# Altium schematic sheet MCU.SchDoc
size A3
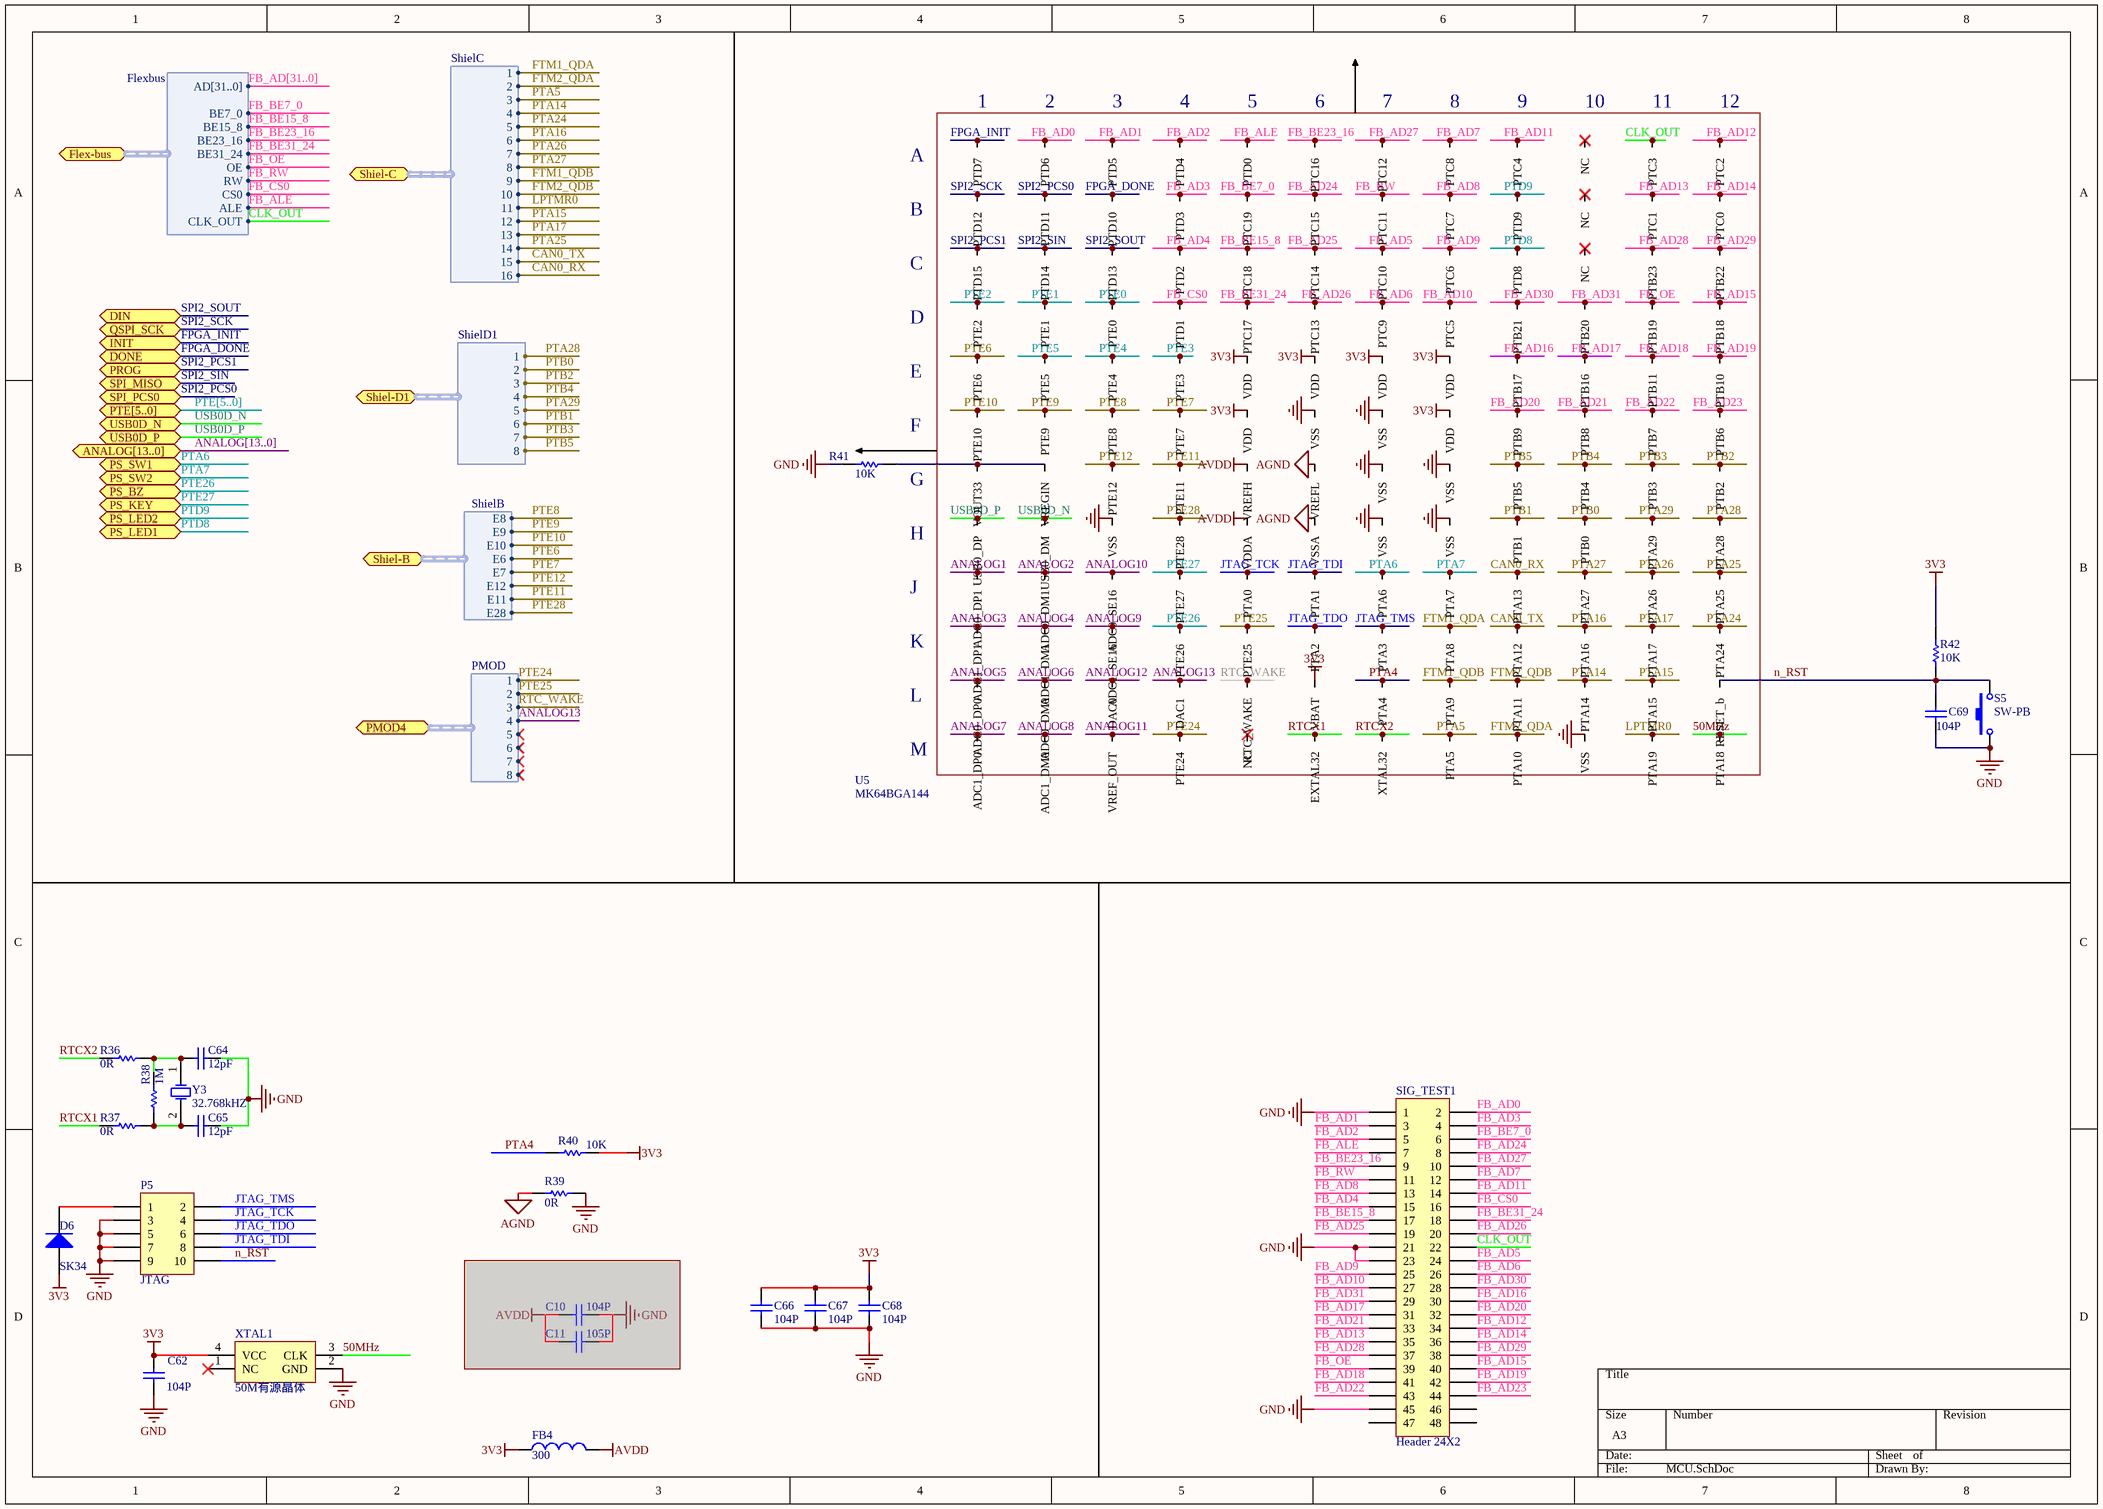
[diagram p0: MCU.SchDoc]

## Parts
C10  value 104P  [0402]  (hidden comment: Cap)  (masked out: inside a compile mask, not in the netlist)
C11  value 105P  [0402]  (hidden comment: Cap)  (masked out: inside a compile mask, not in the netlist)
C62  value 104P  [1608[0603]]  (hidden comment: Cap)
C64  value 12pF  [1608[0603]]  (hidden comment: Cap)
C65  value 12pF  [1608[0603]]  (hidden comment: Cap)
C66  value 104P  [1608[0603]]  (hidden comment: Cap)
C67  value 104P  [1608[0603]]  (hidden comment: Cap)
C68  value 104P  [1608[0603]]  (hidden comment: Cap)
C69  value 104P  [1608[0603]]  (hidden comment: Cap)
D6  SK34  [C2012]
FB4  value 300  [1608[0603]]  (hidden comment: Inductor)
P5  JTAG  [HDR2X5]
R36  value 0R  [1608[0603]]  (hidden comment: Res)
R37  value 0R  [1608[0603]]  (hidden comment: Res)
R38  value 1M  [1608[0603]]  (hidden comment: Res)
R39  value 0R  [1608[0603]]  (hidden comment: Res)
R40  value 10K  [1608[0603]]  (hidden comment: Res)
R41  value 10K  [1608[0603]]  (hidden comment: Res)
R42  value 10K  [1608[0603]]  (hidden comment: Res)
S5  SW-PB  [key 3*4*2]
SIG_TEST1  Header 24X2  [FFC/SM0.5-2H45]
U5  MK64BGA144  [BGA144C100P12X12_1300X1300X161]
XTAL1  50M有源晶体  [XTAL7_3225]
Y3  32.768kHZ  [3215]

## Ports
ANALOG[13..0] (harness Flexbus), DIN, DONE, Flex-bus (harness Flexbus), INIT, PMOD4 (harness PMOD), PROG, PS_BZ, PS_KEY, PS_LED1, PS_LED2, PS_SW1, PS_SW2, PTE[5..0], QSPI_SCK, Shiel-B (harness ShielB), Shiel-C (harness ShielC), Shiel-D1 (harness ShielD1), SPI_MISO, SPI_PCS0, USB0D_N, USB0D_P

## Harnesses
Flexbus: BE7_0, CS0, BE31_24, CLK_OUT, ALE, BE23_16, RW, BE15_8, OE, AD[31..0]
ShielB: E8, E9, E10, E6, E7, E12, E11, E28
ShielC: 1, 2, 3, 4, 5, 6, 7, 8, 9, 10, 11, 12, 13, 14, 15, 16
ShielD1: 1, 2, 3, 4, 5, 6, 7, 8
PMOD: 1, 2, 3, 4, 5, 6, 7, 8

## Nets
3V3: C62.2 C66.2 C67.2 C68.2 D6.1(A) FB4.1 R40.1 R42.1 U5.E5(VDD) U5.E6(VDD) U5.E7(VDD) U5.E8(VDD) U5.F5(VDD) U5.F8(VDD) U5.L6(VBAT) XTAL1.4(VCC)
AGND: R39.2 U5.G6(VREFL) U5.H6(VSSA)
AVDD: FB4.2 U5.G5(VREFH) U5.H5(VDDA)
GND: C62.1 C64.1 C65.1 C66.1 C67.1 C68.1 C69.1 P5.3 P5.5 P5.7 P5.9 R39.1 R41.1 S5.1 SIG_TEST1.1 SIG_TEST1.21 SIG_TEST1.23 SIG_TEST1.45 U5.F6(VSS) U5.F7(VSS) U5.G7(VSS) U5.G8(VSS) U5.H3(VSS) U5.H7(VSS) U5.H8(VSS) U5.M10(VSS) XTAL1.2(GND)
50MHz: U5.M12(PTA18) XTAL1.3(CLK)
ANALOG1: U5.J1(ADC0_DP1)
ANALOG2: U5.J2(ADC0_DM1)
ANALOG3: U5.K1(ADC1_DP1)
ANALOG4: U5.K2(ADC1_DM1)
ANALOG5: U5.L1(ADC0_DP0)
ANALOG6: U5.L2(ADC0_DM0)
ANALOG7: U5.M1(ADC1_DP0)
ANALOG8: U5.M2(ADC1_DM0)
ANALOG9: U5.K3(ADC1_SE16)
ANALOG10: U5.J3(ADC0_SE16)
ANALOG11: U5.M3(VREF_OUT)
ANALOG12: U5.L3(DAC0)
ANALOG13: U5.L4(DAC1) ; port PMOD4.4
CAN0_RX: U5.J9(PTA13) ; port Shiel-C.16
CAN0_TX: U5.K9(PTA12) ; port Shiel-C.15
CLK_OUT: SIG_TEST1.22 U5.A11(PTC3) ; port Flex-bus.CLK_OUT
FB_AD0: SIG_TEST1.2 U5.A2(PTD6)
FB_AD1: SIG_TEST1.3 U5.A3(PTD5)
FB_AD2: SIG_TEST1.5 U5.A4(PTD4)
FB_AD3: SIG_TEST1.4 U5.B4(PTD3)
FB_AD4: SIG_TEST1.15 U5.C4(PTD2)
FB_AD5: SIG_TEST1.24 U5.C7(PTC10)
FB_AD6: SIG_TEST1.26 U5.D7(PTC9)
FB_AD7: SIG_TEST1.12 U5.A8(PTC8)
FB_AD8: SIG_TEST1.13 U5.B8(PTC7)
FB_AD9: SIG_TEST1.25 U5.C8(PTC6)
FB_AD10: SIG_TEST1.27 U5.D8(PTC5)
FB_AD11: SIG_TEST1.14 U5.A9(PTC4)
FB_AD12: SIG_TEST1.34 U5.A12(PTC2)
FB_AD13: SIG_TEST1.35 U5.B11(PTC1)
FB_AD14: SIG_TEST1.36 U5.B12(PTC0)
FB_AD15: SIG_TEST1.40 U5.D12(PTB18)
FB_AD16: SIG_TEST1.30 U5.E9(PTB17)
FB_AD17: SIG_TEST1.31 U5.E10(PTB16)
FB_AD18: SIG_TEST1.41 U5.E11(PTB11)
FB_AD19: SIG_TEST1.42 U5.E12(PTB10)
FB_AD20: SIG_TEST1.32 U5.F9(PTB9)
FB_AD21: SIG_TEST1.33 U5.F10(PTB8)
FB_AD22: SIG_TEST1.43 U5.F11(PTB7)
FB_AD23: SIG_TEST1.44 U5.F12(PTB6)
FB_AD24: SIG_TEST1.8 U5.B6(PTC15)
FB_AD25: SIG_TEST1.19 U5.C6(PTC14)
FB_AD26: SIG_TEST1.20 U5.D6(PTC13)
FB_AD27: SIG_TEST1.10 U5.A7(PTC12)
FB_AD28: SIG_TEST1.37 U5.C11(PTB23)
FB_AD29: SIG_TEST1.38 U5.C12(PTB22)
FB_AD30: SIG_TEST1.28 U5.D9(PTB21)
FB_AD31: SIG_TEST1.29 U5.D10(PTB20)
FB_ALE: SIG_TEST1.7 U5.A5(PTD0) ; port Flex-bus.ALE
FB_BE7_0: SIG_TEST1.6 U5.B5(PTC19) ; port Flex-bus.BE7_0
FB_BE15_8: SIG_TEST1.17 U5.C5(PTC18) ; port Flex-bus.BE15_8
FB_BE23_16: SIG_TEST1.9 U5.A6(PTC16) ; port Flex-bus.BE23_16
FB_BE31_24: SIG_TEST1.18 U5.D5(PTC17) ; port Flex-bus.BE31_24
FB_CS0: SIG_TEST1.16 U5.D4(PTD1) ; port Flex-bus.CS0
FB_OE: SIG_TEST1.39 U5.D11(PTB19) ; port Flex-bus.OE
FB_RW: SIG_TEST1.11 U5.B7(PTC11) ; port Flex-bus.RW
FPGA_DONE: U5.B3(PTD10) ; port DONE
FPGA_INIT: U5.A1(PTD7) ; port INIT
FTM1_QDA: U5.K8(PTA8) ; port Shiel-C.1
FTM1_QDB: U5.L8(PTA9) ; port Shiel-C.9
FTM2_QDA: U5.M9(PTA10) ; port Shiel-C.2
FTM2_QDB: U5.L9(PTA11) ; port Shiel-C.10
JTAG_TCK: P5.4 U5.J5(PTA0)
JTAG_TDI: P5.8 U5.J6(PTA1)
JTAG_TDO: P5.6 U5.K6(PTA2)
JTAG_TMS: P5.2 U5.K7(PTA3)
LPTMR0: U5.M11(PTA19) ; port Shiel-C.11
n_RST: C69.2 P5.10 R42.2 S5.2 U5.L12(RESET_b)
PTA4: R40.2 U5.L7(PTA4)
PTA5: U5.M8(PTA5) ; port Shiel-C.3
PTA6: U5.J7(PTA6) ; port PS_SW1
PTA7: U5.J8(PTA7) ; port PS_SW2
PTA14: U5.L10(PTA14) ; port Shiel-C.4
PTA15: U5.L11(PTA15) ; port Shiel-C.12
PTA16: U5.K10(PTA16) ; port Shiel-C.6
PTA17: U5.K11(PTA17) ; port Shiel-C.13
PTA24: U5.K12(PTA24) ; port Shiel-C.5
PTA25: U5.J12(PTA25) ; port Shiel-C.14
PTA26: U5.J11(PTA26) ; port Shiel-C.7
PTA27: U5.J10(PTA27) ; port Shiel-C.8
PTA28: U5.H12(PTA28) ; port Shiel-D1.1
PTA29: U5.H11(PTA29) ; port Shiel-D1.5
PTB0: U5.H10(PTB0) ; port Shiel-D1.2
PTB1: U5.H9(PTB1) ; port Shiel-D1.6
PTB2: U5.G12(PTB2) ; port Shiel-D1.3
PTB3: U5.G11(PTB3) ; port Shiel-D1.7
PTB4: U5.G10(PTB4) ; port Shiel-D1.4
PTB5: U5.G9(PTB5) ; port Shiel-D1.8
PTD8: U5.C9(PTD8) ; port PS_LED1
PTD9: U5.B9(PTD9) ; port PS_LED2
PTE0: U5.D3(PTE0)
PTE1: U5.D2(PTE1)
PTE2: U5.D1(PTE2)
PTE3: U5.E4(PTE3)
PTE4: U5.E3(PTE4)
PTE5: U5.E2(PTE5)
PTE6: U5.E1(PTE6) ; port Shiel-B.E6
PTE7: U5.F4(PTE7) ; port Shiel-B.E7
PTE8: U5.F3(PTE8) ; port Shiel-B.E8
PTE9: U5.F2(PTE9) ; port Shiel-B.E9
PTE10: U5.F1(PTE10) ; port Shiel-B.E10
PTE11: U5.G4(PTE11) ; port Shiel-B.E11
PTE12: U5.G3(PTE12) ; port Shiel-B.E12
PTE24: U5.M4(PTE24) ; port PMOD4.1
PTE25: U5.K5(PTE25) ; port PMOD4.2
PTE26: U5.K4(PTE26) ; port PS_BZ
PTE27: U5.J4(PTE27) ; port PS_KEY
PTE28: U5.H4(PTE28) ; port Shiel-B.E28
RTC_WAKE: U5.L5(RTC_WAKE) ; port PMOD4.3
RTCX1: R37.2 U5.M6(EXTAL32)
RTCX2: R36.2 U5.M7(XTAL32)
SPI2_PCS0: U5.B2(PTD11) ; port SPI_PCS0
SPI2_PCS1: U5.C1(PTD15) ; port PROG
SPI2_SCK: U5.B1(PTD12) ; port QSPI_SCK
SPI2_SIN: U5.C2(PTD14) ; port SPI_MISO
SPI2_SOUT: U5.C3(PTD13) ; port DIN
USB0D_N: U5.H2(USB0_DM) ; port USB0D_N
USB0D_P: U5.H1(USB0_DP) ; port USB0D_P
NetC64_2: C64.2 R36.1 R38.1 Y3.1(OSC1)
NetC65_2: C65.2 R37.1 R38.2 Y3.2(OSC2)
NetD6_2: D6.2(K) P5.1
NetR41_2: R41.2 U5.G1(VOUT33) U5.G2(VREGIN)

Not connected (* = marked no-connect by the designer): SIG_TEST1 46 47 48; U5 A10(NC)* B10(NC)* C10(NC)* M5(NC)*; XTAL1 1(NC)*

## Buses and harness runs
bus ANALOG[13..0]
bus FB_AD[31..0]
bus PTE[5..0] = port PTE[5..0]

## Notes on the sheet
- (in symbol MK64BGA144) 1; 2; 3; 4; 5; 6; 7; 8; 9; 10; 11; 12; A; B; C; D; E; F; G; H; J; K; L; M

## Library data of the parts
C10 C11 C62 C64-C69 = Cap: 贴片电容; Published: 8-Jun-2000; LatestRevisionDate: 17-Jul-2002; LatestRevisionNote: Re-released for DXP Platform.; PackageReference: RAD-0.3; Publisher: Altium Limited
D6 = Diode 1N4148: High Conductance Fast Diode; LatestRevisionDate: 17-Jul-2002; LatestRevisionNote: Re-released for DXP Platform.; DatasheetDocument: 1997; PackageReference: DO-35; Publisher: Altium Limited; Code_JEDEC: DO-204-AH; ComponentLink1Description: Manufacturer Link; ComponentLink2Description: Datasheet; ComponentLink2URL: http://www.fairchildsemi.com/ds/1N%2F1N4148.pdf
FB4 = Inductor: Code_IEC: 1005; Published: 8-Jun-2000; LatestRevisionDate: 29-May-2009; LatestRevisionNote: IPC-7351 Footprint Added.; PackageReference: 0402-A; Publisher: Altium Limited; PackageDescription: Chip Inductor; Code_JEITA: 0402
P5 = Header 5X2: Header, 5-Pin, Dual row; LatestRevisionDate: 17-Jul-2002; LatestRevisionNote: Re-released for DXP Platform.; Publisher: Altium Limited
R36-R42 = Res: 贴片电阻; Published: 8-Jun-2000; LatestRevisionDate: 17-Jul-2002; LatestRevisionNote: Re-released for DXP Platform.; PackageReference: AXIAL-0.3; Publisher: Altium Limited
S5 = SW-PB: Switch
SIG_TEST1 = Header 24X2: Header, 24-Pin, Dual row; LatestRevisionDate: 17-Jul-2002; LatestRevisionNote: Re-released for DXP Platform.; Publisher: Altium Limited
XTAL1 = 有源晶体
Y3 = XTAL: 晶体振荡器; Published: 8-Jun-2000; LatestRevisionDate: 17-Jul-2002; LatestRevisionNote: Re-released for DXP Platform.; PackageReference: R38; Publisher: Altium Limited